# Altium schematic sheet Ethernet PHY.SchDoc
size A; SheetNumber: 4; SheetTotal: 4
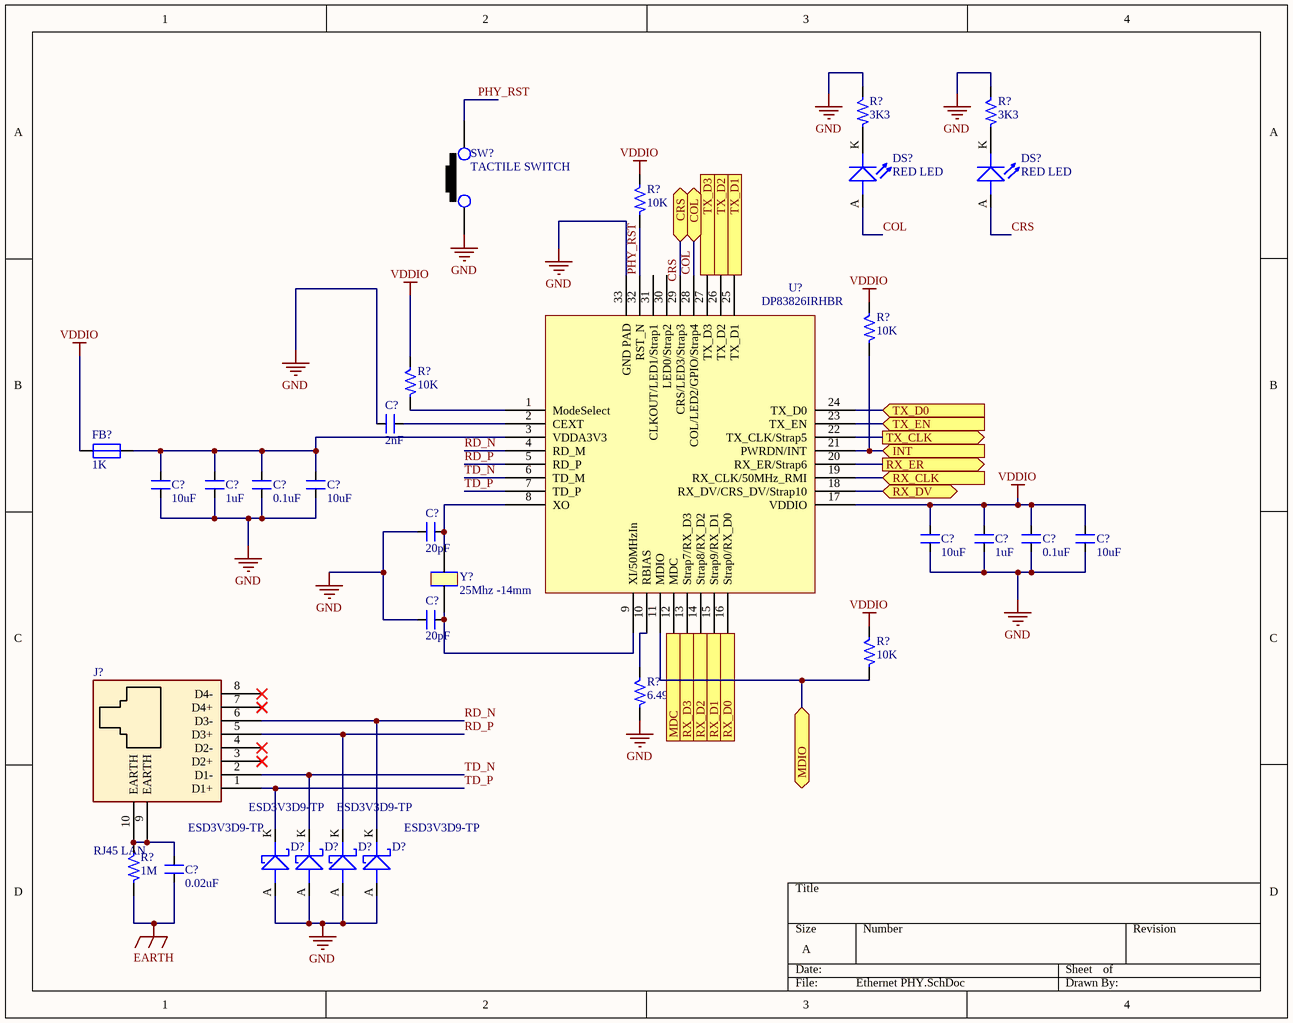
[diagram p0: Ethernet PHY.SchDoc]

## Parts
(Parts that share a designator on the sheet are numbered #1, #2 ... from top to bottom, then left to right.)
C?#1  2nF  [CAP_0805]
C?#2  10uF  [CAP_1206]
C?#3  1uF  [CAP_0805]
C?#4  0.1uF  [CAP_0805]
C?#5  10uF  [CAP_1206]
C?#6  20pF  [CAP_0805]
C?#7  10uF  [CAP_1206]
C?#8  1uF  [CAP_0805]
C?#9  0.1uF  [CAP_0805]
C?#10  10uF  [CAP_1206]
C?#11  20pF  [CAP_0805]
C?#12  0.02uF  [CAP_1812]
D?#1  ESD3V3D9-TP  [DIO_SOD-923]
D?#2  ESD3V3D9-TP  [DIO_SOD-923]
D?#3  ESD3V3D9-TP  [DIO_SOD-923]
D?#4  ESD3V3D9-TP  [DIO_SOD-923]
DS?#1  RED LED  [LED_0805]
DS?#2  RED LED  [LED_0805]
FB?  1K  [IND_0805]
J?  RJ45 LAN  [CON10_P106_RJ45_TH_ST]
R?#1  3K3  [RES_0603]
R?#2  3K3  [RES_0603]
R?#3  10K  [RES_0603]
R?#4  10K  [RES_0603]
R?#5  10K  [RES_0603]
R?#6  10K  [RES_0805]
R?#7  6.49K  [RES_0805]
R?#8  1M  [RES_1206]
SW?  TACTILE SWITCH  [SW_342_SMD]
U?  DP83826IRHBR  [VQFN32_19_218_23X9_SMD]
Y?  25Mhz -14mm  [XTAL_314_240X47_SMD]

## Ports
COL (bidir), CRS (bidir), INT (in), MDC (in), MDIO (bidir), RX_CLK (in), RX_D0 (out), RX_D1 (out), RX_D2 (out), RX_D3 (out), RX_DV (bidir), RX_ER (out), TX_CLK (out), TX_D0 (in), TX_D1 (in), TX_D2 (in), TX_D3 (in), TX_EN (in)

## Nets
EARTH: C?#12.1 R?#8.2
GND: C?#1.1 C?#2.2 C?#3.2 C?#4.2 C?#5.2 C?#6.1 C?#7.2 C?#8.2 C?#9.2 C?#10.2 C?#11.1 D?#1.A D?#2.A D?#3.A D?#4.A R?#1.1 R?#2.1 R?#7.2 SW?.1 U?.33(GND_PAD)
VDDIO: C?#7.1 C?#8.1 C?#9.1 C?#10.1 FB?.1 R?#3.1 R?#4.1 R?#5.1 R?#6.1 U?.17(VDDIO)
COL: DS?#1.A(ANODE) U?.28(COL/LED2/GPIO/Strap4) ; port COL
CRS: U?.29(CRS/LED3/Strap3) ; port CRS
CRS: DS?#2.A(ANODE)  [a separate net that carries the same name]
INT: R?#4.2 U?.21(PWRDN/INT) ; port INT
MDC: U?.12(MDC) ; port MDC
MDIO: R?#6.2 U?.11(MDIO) ; port MDIO
PHY_RST: R?#3.2 SW?.2 U?.32(RST_N)
RD_N: D?#4.K J?.6(D3-) U?.4(RD_M)
RD_P: D?#3.K J?.5(D3+) U?.5(RD_P)
RX_CLK: U?.19(RX_CLK/50MHz_RMI) ; port RX_CLK
RX_D0: U?.16(Strap0/RX_D0) ; port RX_D0
RX_D1: U?.15(Strap9/RX_D1) ; port RX_D1
RX_D2: U?.14(Strap8/RX_D2) ; port RX_D2
RX_D3: U?.13(Strap7/RX_D3) ; port RX_D3
RX_DV: U?.18(RX_DV/CRS_DV/Strap10) ; port RX_DV
RX_ER: U?.20(RX_ER/Strap6) ; port RX_ER
TD_N: D?#2.K J?.2(D1-) U?.6(TD_M)
TD_P: D?#1.K J?.1(D1+) U?.7(TD_P)
TX_CLK: U?.22(TX_CLK/Strap5) ; port TX_CLK
TX_D0: U?.24(TX_D0) ; port TX_D0
TX_D1: U?.25(TX_D1) ; port TX_D1
TX_D2: U?.26(TX_D2) ; port TX_D2
TX_D3: U?.27(TX_D3) ; port TX_D3
TX_EN: U?.23(TX_EN) ; port TX_EN
NetC?#1_2: C?#1.2 U?.2(CEXT)
NetC?#2_1: C?#2.1 C?#3.1 C?#4.1 C?#5.1 FB?.2 U?.3(VDDA3V3)
NetC?#6_2: C?#6.2 U?.8(XO) Y?.1
NetC?#11_2: C?#11.2 U?.9(XI/50MHzIn) Y?.2
NetC?#12_2: C?#12.2 J?.9(EARTH) J?.10(EARTH) R?#8.1
NetDS?#1_K: DS?#1.K(CATHODE) R?#1.2
NetDS?#2_K: DS?#2.K(CATHODE) R?#2.2
NetR?#5_2: R?#5.2 U?.1(ModeSelect)
NetR?#7_1: R?#7.1 U?.10(RBIAS)

Not connected (* = marked no-connect by the designer): J? 3(D2+)* 4(D2-)* 7(D4+)* 8(D4-)*; U? 30(LED0/Strap2) 31(CLKOUT/LED1/Strap1)

## Notes on the sheet
- Labels drawn without touching a wire or pin: CRS

## Library data of the parts
C?#1 = CAP_2nF-50V-10%-0805: 2000pF ±10% 50V Ceramic Capacitor X7R 0805 (2012 Metric); Manufacturer: Samsung Electro-Mechanics; Manufacturer Part Number: CL21B202KBANNNC; Alternate Part Number-1: NA; Case/Package: 0805; Supplier-1: Digikey; Supplier Part Number-1: 1276-2471-1-ND - Cut Tape (CT)
C?#2 C?#5 C?#7 C?#10 = CAP_10uF-50V-10%-1206: 10µF ±10% 50V Ceramic Capacitor X7R 1206 (3216 Metric); Manufacturer: KEMET; Manufacturer Part Number: CL31B106KBHNNNE; Alternate Part Number-1: GRT31CR61H106ME01L; Case/Package: 1206; Supplier-1: SIRICOM; Supplier Part Number-1: CC1206KKX5R9BB106
C?#3 C?#8 = CAP_1uF-50V-5%-0805: 1µF ±5% 50V Ceramic Capacitor X7R 0805 (2012 Metric); Manufacturer: Samsung; Manufacturer Part Number: CC0805JKX7R9BB105; Alternate Part Number-1: 0805F105M500NT; Case/Package: 0805; Supplier-1: SIRICOM; Supplier Part Number-1: CL21B105KBFNNNE
C?#4 C?#9 = CAP_0.1uF-50V-5%-0805: 0.1µF ±5% 50V Ceramic Capacitor X7R 0805 (2012 Metric); Manufacturer: AVX Corporation; Manufacturer Part Number: 08055C104JAT4A; Alternate Part Number-1: 0805B104M500; Case/Package: 0805; Supplier-1: SIRICOM; Supplier Part Number-1: 0805B104J500CT
C?#6 C?#11 = CAP_20pF-50V-10%-0805: ±10% 50V Ceramic Capacitor C0G, NP0 0805 (2012 Metric); Manufacturer: AVX Corporation; Manufacturer Part Number: 08055A200KAT2A; Alternate Part Number-1: NA; Case/Package: 0805; Supplier-1: Digikey; Supplier Part Number-1: 478-11887-1-ND - Cut Tape (CT)
C?#12 = CAP_20nF-1KV-20%-1812: 0.02µF ±20% 1000V (1kV) Ceramic Capacitor X7R 1812 (4532 Metric); Manufacturer: TDK; Manufacturer Part Number: 1812AC203MAT1A; Alternate Part Number-1: NA; Case/Package: 1812; Supplier-1: Mouser; Supplier Part Number-1: 581-1812AC203M
D?#1-D?#4 = DIO-T_3.3V-8.8V-SOD923: 8.8V Clamp 5A (8/20µs) Ipp Tvs Diode Surface Mount SOD-923; Manufacturer: Micro Commercial Co; Alternate Part Number-1: NA; Manufacturer Part Number: ESD3V3D9-TP; Case/Package: SOD923; Supplier-1: Digikey; Supplier Part Number-1: ESD3V3D9-TPMSCT-ND - Cut Tape (CT)
DS?#1 DS?#2 = LED_RED-2V-20mA-0805: Red 631nm LED Indication - Discrete 2V 0805 (2012 Metric); Manufacturer: Vishay Lite-On; Manufacturer Part Number: LTST-C171KRKT; Alternate Part Number-1: NA; Case/Package: 0805; Supplier-1: SP ROAD; Supplier Part Number-1: LTST-C171KRKT
FB? = FB_1K-100MHZ-1.6A-0805: 1 kOhms @ 100MHz 1 Power Line Ferrite Bead 0805 (2012 Metric) 1.6A; Manufacturer: Laird; Manufacturer Part Number: BLM21SP102SH1D; Alternate Part Number-1: NA; Case/Package: 0805; Supplier-1: SIRICOM; Supplier Part Number-1: ACMS201209A102
J? = CON-SKT-RJ_8C8P-RA-TH: 8 Pins, 2 Row 2.54mm Pitch, right angle Connector, male; Manufacturer: Assmann; Manufacturer Part Number: A-2004-2-4-LPS-N-R; Alternate Part Number-1: NA; Case/Package: TH-CON; Supplier-1: SP ROAD; Supplier Part Number-1: A-2004-2-4-LPS-N-R
R?#1 R?#2 = RES_3.3K-0.1W-1%-0603: 3.3 kOhms ±1% 0.1W, 1/10W Chip Resistor 0603 (1608 Metric) Automotive AEC-Q200 Thick Film; Manufacturer: Wilson; Manufacturer Part Number: WR06X3301FTL; Alternate Part Number-1: 0603WAF3301T5E; Case/Package: 0603; Supplier-1: SIRICOM; Supplier Part Number-1: WR06X3301FTL
R?#3-R?#5 = RES_10K-0.1W-1%-0603: 10 kOhms ±1% 0.1W, 1/10W Chip Resistor 0603 (1608 Metric) Automotive AEC-Q200 Thick Film; Manufacturer: Walsin; Manufacturer Part Number: WR06X1002FTL; Alternate Part Number-1: 0603WAJ0103T5E; Case/Package: 0603; Supplier-1: SIRICOM; Supplier Part Number-1: WR06X1002FTL
R?#6 = RES_10K-0.125W-1%-0805: 10 kOhms ±1% 0.125W, 1/8W Chip Resistor 0805 (2012 Metric) Automotive AEC-Q200 Thick Film; Manufacturer: CTS; Manufacturer Part Number: WR08X1002FTL; Case/Package: 0805; Supplier-1: SIRICOM; Supplier Part Number-1: WR08X1002FTL; Alternate Part Number-1: WR08X1002FTL
R?#7 = RES_6.49K-0.125W-1%-0805: 6.49 kOhms ±1% 0.125W, 1/8W Chip Resistor 0805 (2012 Metric) Moisture Resistant Thick Film; Manufacturer: Stackpole Electronics; Manufacturer Part Number: RC0805FR-076K49L; Alternate Part Number-1: NA; Case/Package: 0805; Supplier-1: SIRICOM; Supplier Part Number-1: WRO8X6491FTL
R?#8 = RES_1M-0.25W-1%-1206: 1 MOhms ±1% 0.25W, 1/4W Chip Resistor 1206 (3216 Metric) Automotive AEC-Q200, High Voltage Thick Film; Manufacturer: Walsin; Manufacturer Part Number: WR12X1004FTL; Alternate Part Number-1: NA; Case/Package: 1206; Supplier-1: SIRICOM; Supplier Part Number-1: WR12X1004FTL
SW? = SW1_RS-282G05A3-SMRT-SMD: Tactile Switch SPST-NO Top Actuated Surface Mount; Manufacturer: ITT C&K; Alternate Part Number-1: NA; Manufacturer Part Number: RS-282G05A3-SMRT; Case/Package: SMD; Supplier-1: SP ROAD; Supplier Part Number-1: RS-282G05A3-SMRT
U? = IC_DP83826IRHBR: Ethernet ICs Low latency 10/100-Mbps PHY, MII interface and enhanced mode with an industrial temperature range 32-VQFN -40 to 85; Manufacturer: Texas Instruments; Alternate Part Number-1: NA; Manufacturer Part Number: DP83826IRHBR; Case/Package: 32-VQFN; Supplier-1: Mouser; Supplier Part Number-1: 595-DP83826IRHBR
Y? = XTAL_25Mhz-FOXSDLF/250F-20: 25MHz ±30ppm Crystal 20pF 30 Ohms HC-49/US; Manufacturer: Abracon; Alternate Part Number-1: NA; Manufacturer Part Number: FOXSDLF/250F-20; Case/Package: SMD; Supplier-1: MOUSER; Supplier Part Number-1: FOXSDLF/250F-20